# EAGLE design Proper (EAGLE 9.6.2)
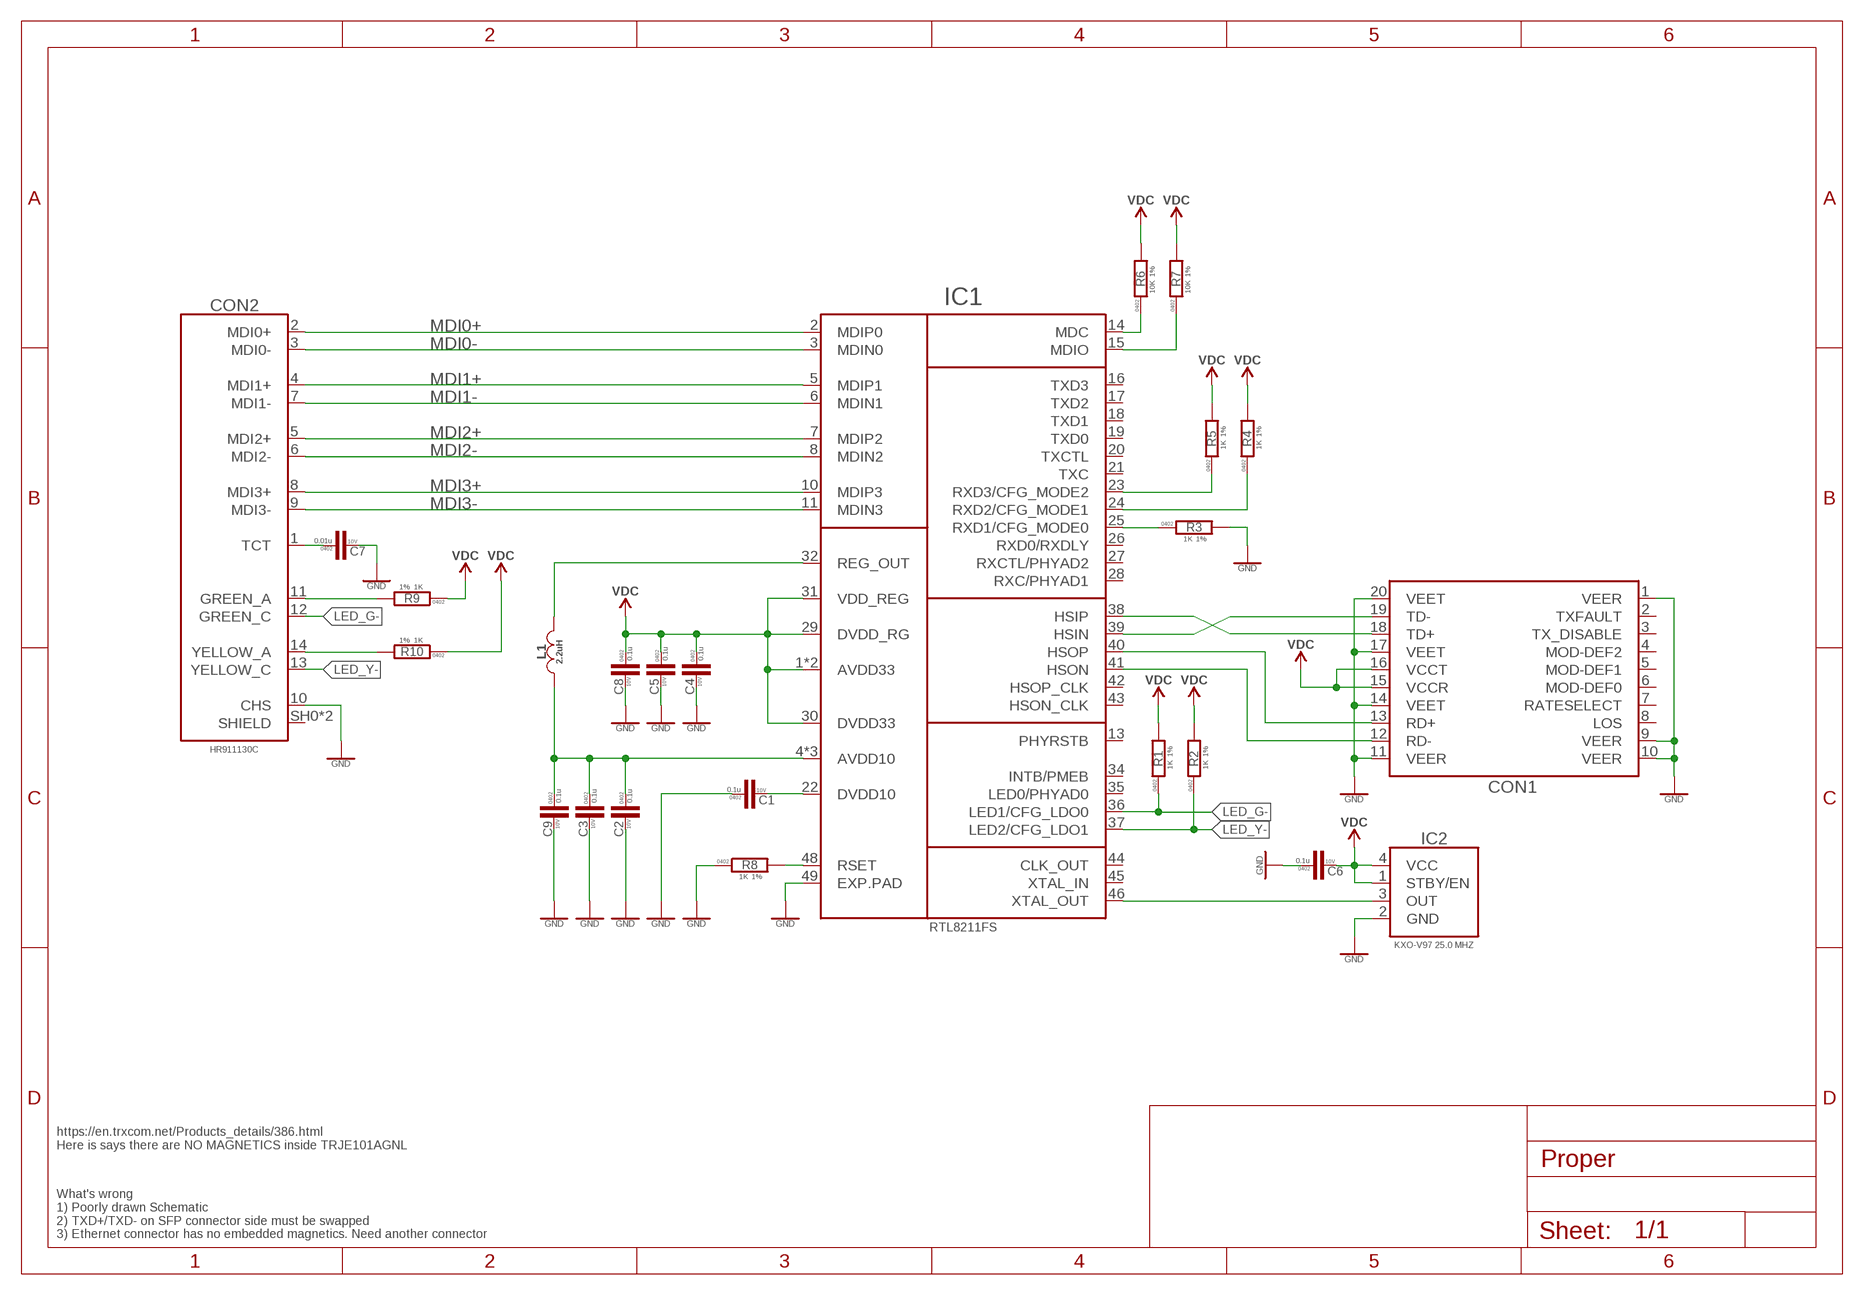
[diagram p0: schematic, sheet 1]

## Parts
C1  0.1u  C-0402  [C0402]
C2  0.1u  C-0402  [C0402]
C3  0.1u  C-0402  [C0402]
C4  0.1u  C-0402  [C0402]
C5  0.1u  C-0402  [C0402]
C6  0.1u  C-0402  [C0402]
C7  0.01u  C-0402  [C0402]
C8  0.1u  C-0402  [C0402]
C9  0.1u  C-0402  [C0402]
CON1  SFA_EDGE_CON  [SFP_EDGE_CON]
CON2  HR911130C  [HR911130C]
IC1  RTL8211FS  [QFN40]
IC2  OSCILLATOR-KXO-V97  [KXO-V97]
L1  2.2uH  L-0805  [L0805]
R1  1K  R-1%-0402  [R0402]
R2  1K  R-1%-0402  [R0402]
R3  1K  R-1%-0402  [R0402]
R4  1K  R-1%-0402  [R0402]
R5  1K  R-1%-0402  [R0402]
R6  10K  R-1%-0402  [R0402]
R7  10K  R-1%-0402  [R0402]
R8  1K  R-1%-0402  [R0402]
R9  1K  R-1%-0402  [R0402]
R10  1K  R-1%-0402  [R0402]

## Nets
GND: C1.1 C2.2 C3.2 C4.2 C5.2 C6.1 C7.2 C8.2 C9.2 CON1.1(VEER) CON1.9(VEER) CON1.10(VEER) CON1.11(VEER) CON1.14(VEET) CON1.17(VEET) CON1.20(VEET) CON2.10(CHS) IC1.49(EXP.PAD) IC2.2(GND) R3.2 R8.1
LED_G-: CON2.12(GREEN_C) IC1.36(LED1/CFG_LDO0) R1.1
LED_Y-: CON2.13(YELLOW_C) IC1.37(LED2/CFG_LDO1) R2.1
MDI0+: CON2.2(MDI0+) IC1.2(MDIP0)
MDI0-: CON2.3(MDI0-) IC1.3(MDIN0)
MDI1+: CON2.4(MDI1+) IC1.5(MDIP1)
MDI1-: CON2.7(MDI1-) IC1.6(MDIN1)
MDI2+: CON2.5(MDI2+) IC1.7(MDIP2)
MDI2-: CON2.6(MDI2-) IC1.8(MDIN2)
MDI3+: CON2.8(MDI3+) IC1.10(MDIP3)
MDI3-: CON2.9(MDI3-) IC1.11(MDIN3)
N$1: CON1.18(TD+) IC1.38(HSIP)
N$2: CON1.19(TD-) IC1.39(HSIN)
N$3: IC1.23(RXD3/CFG_MODE2) R5.1
N$4: IC1.24(RXD2/CFG_MODE1) R4.1
N$5: IC1.25(RXD1/CFG_MODE0) R3.1
N$6: IC1.14(MDC) R6.1
N$7: IC1.15(MDIO) R7.1
N$8: IC1.48(RSET) R8.2
N$9: C1.2 IC1.22(DVDD10)
N$10: IC1.32(REG_OUT) L1.2
N$11: C2.1 C3.1 C9.1 IC1.4(AVDD10) IC1.9(AVDD10) IC1.47(AVDD10) L1.1
N$12: C7.1 CON2.1(TCT)
N$14: CON1.13(RD+) IC1.40(HSOP)
N$15: CON1.12(RD-) IC1.41(HSON)
N$16: CON2.11(GREEN_A) R9.2
N$17: IC1.46(XTAL_OUT) IC2.3(OUT)
N$18: CON2.14(YELLOW_A) R10.2
VDC: C4.1 C5.1 C6.2 C8.1 CON1.15(VCCR) CON1.16(VCCT) IC1.1(AVDD33) IC1.12(AVDD33) IC1.29(DVDD_RG) IC1.30(DVDD33) IC1.31(VDD_REG) IC2.1(STBY/EN) IC2.4(VCC) R1.2 R2.2 R4.2 R5.2 R6.2 R7.2 R9.1 R10.1
Unconnected: CON1.2(TXFAULT) CON1.3(TX_DISABLE) CON1.4(MOD-DEF2) CON1.5(MOD-DEF1) CON1.6(MOD-DEF0) CON1.7(RATESELECT) CON1.8(LOS) CON2.SH0(SHIELD) CON2.SH1(SHIELD) IC1.13(PHYRSTB) IC1.16(TXD3) IC1.17(TXD2) IC1.18(TXD1) IC1.19(TXD0) IC1.20(TXCTL) IC1.21(TXC) IC1.26(RXD0/RXDLY) IC1.27(RXCTL/PHYAD2) IC1.28(RXC/PHYAD1) IC1.34(INTB/PMEB) IC1.35(LED0/PHYAD0) IC1.42(HSOP_CLK) IC1.43(HSON_CLK) IC1.44(CLK_OUT) IC1.45(XTAL_IN)

## Notes on the sheet
- https://en.trxcom.net/Products_details/386.html
  Here is says there are NO MAGNETICS inside TRJE101AGNL
- What's wrong
  1) Poorly drawn Schematic 
  2) TXD+/TXD- on SFP connector side must be swapped
  3) Ethernet connector has no embedded magnetics. Need another connector

## Library data of the parts
C1-C9 = rc:C; PACKAGE: 0402; VOLTAGE: 10V
CON1 = misc:SFA_EDGE_CON
CON2 = Connectors:HR911130C: Single Port RJ45 Connector with Integrated Magnetics and LED 100/1000Base-T Magnetics; MANF: HanRun; MANF#: HR911130C
IC1 = misc:RTL8211FS: Highly integrated Ethernet transciever Datasheet <https://static.chipdip.ru/lib/818/DOC059818733.pdf>; MANF: Realtek; MANF#: RTL8211FS
IC2 = crystal:OSCILLATOR: Clock Oscillator; MANF: GEYER; MANF#: KXO-V97 25.0 MHZ
L1 = rc:L
R1-R10 = rc:R; PACKAGE: 0402; TOLERANCE: 1%

## Board
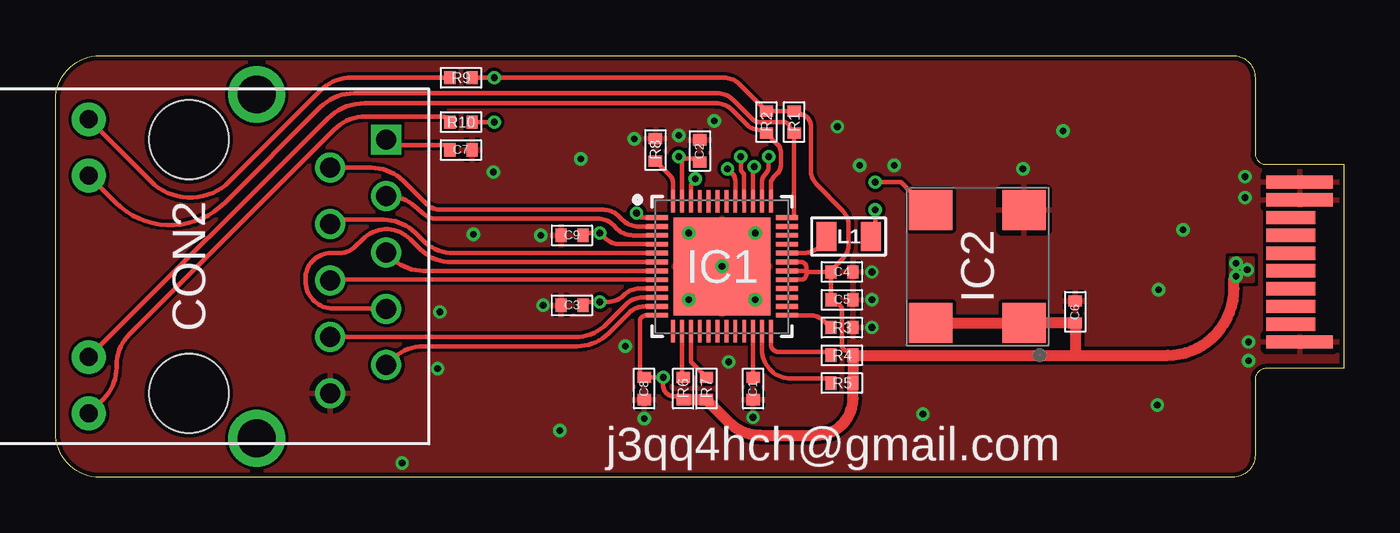
[diagram p1: board, top side]
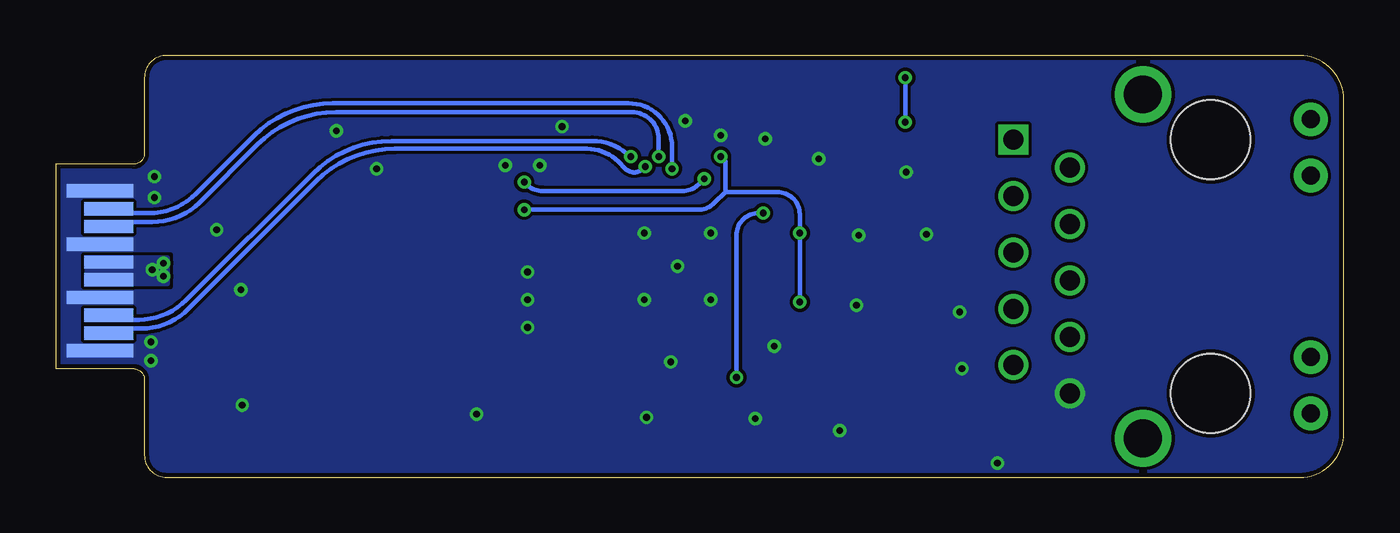
[diagram p2: board, bottom side, seen from below]

Size 58 x 19 mm. Coordinates in mm from the lower left corner, seen from the top.
Outline: 0,2 0,17 arc-90 2,19 53,19 arc-90 54,18 54,14.6 arc90 54.5,14.1 58,14.1 58,4.9 54.5,4.9 arc90 54,4.4 54,1 arc-90 53,0 2,0 arc-90 0,2
Copper layers (1*16): Top 0.035mm / dielectric 1.5mm / Bottom 0.035mm
Design rules "JLCPCB 2 layer": minimum track width 6mil, minimum drill 0.3mm, track to track 0.15mm, track to pad 0.15mm, pad to pad 0.15mm, via to via 0.15mm, smd to smd 0.1mm, copper to edge 0.2mm, drill to drill 6mil, minimum pad ring 0.15mm, minimum via ring 0.15mm, stop-mask expansion 0.05mm, vias tented up to drill 0.5mm, thermal gap 10mil

### Footprints (pad centres in the part's own frame; a part is rotated, then mirrored left to right if it is on the bottom)
C0402 = smd 0.5 x 0.6: 1 -0.5,0; 2 0.5,0
SFP_EDGE_CON = smd 3 x 0.6 bottom: 1 -2,3.4; 9 -2,-3; 10 -2,-3.8 | smd 2.2 x 0.6 bottom: 2 -2.4,2.6; 3 -2.4,1.8; 4 -2.4,1; 5 -2.4,0.2; 6 -2.4,-0.6; 7 -2.4,-1.4; 8 -2.4,-2.2 | smd 3 x 0.6: 11 -2,-3.4; 14 -2,-1; 17 -2,1.4; 20 -2,3.8 | smd 2.2 x 0.6: 12 -2.4,-2.6; 13 -2.4,-1.8; 15 -2.4,-0.2; 16 -2.4,0.6; 18 -2.4,2.2; 19 -2.4,3
HR911130C = drill 0.9 square: 1 5.715,-8.89 | drill 0.9: 2 4.445,-6.35; 3 3.175,-8.89; 4 1.905,-6.35; 5 0.635,-8.89; 6 -0.635,-6.35; 7 -1.905,-8.89; 8 -3.175,-6.35; 9 -4.445,-8.89; 10 -5.715,-6.35 | drill 0.813 pad 1.524: 11 6.625,4.5; 12 4.085,4.5; 13 -4.085,4.5; 14 -6.625,4.5 | drill 1.7: SH0 -7.745,-3.05; SH1 7.745,-3.05 | hole 3.556: 5.715,0; -5.715,0
QFN40 = smd 1 x 0.2: 1 -2.925,2.2; 2 -2.925,1.8; 3 -2.925,1.4; 4 -2.925,1; 5 -2.925,0.6; 6 -2.925,0.2; 7 -2.925,-0.2; 8 -2.925,-0.6; 9 -2.925,-1; 10 -2.925,-1.4; 11 -2.925,-1.8; 12 -2.925,-2.2; 25 2.925,-2.2; 26 2.925,-1.8; 27 2.925,-1.4; 28 2.925,-1; 29 2.925,-0.6; 30 2.925,-0.2; 31 2.925,0.2; 32 2.925,0.6; 33 2.925,1; 34 2.925,1.4; 35 2.925,1.8; 36 2.925,2.2 | smd 0.2 x 1: 13 -2.2,-2.925; 14 -1.8,-2.925; 15 -1.4,-2.925; 16 -1,-2.925; 17 -0.6,-2.925; 18 -0.2,-2.925; 19 0.2,-2.925; 20 0.6,-2.925; 21 1,-2.925; 22 1.4,-2.925; 23 1.8,-2.925; 24 2.2,-2.925; 37 2.2,2.925; 38 1.8,2.925; 39 1.4,2.925; 40 1,2.925; 41 0.6,2.925; 42 0.2,2.925; 43 -0.2,2.925; 44 -0.6,2.925; 45 -1,2.925; 46 -1.4,2.925; 47 -1.8,2.925; 48 -2.2,2.925 | smd 4.4 x 4.4: 49 0,0
KXO-V97 = smd 1.8 x 2: 1 -2.54,-2.1; 2 2.54,-2.1; 3 2.54,2.1; 4 -2.54,2.1
L0805 = smd 0.9 x 1.3: 1 -1,0; 2 1,0
R0402 = smd 0.5 x 0.6: 1 -0.5,0; 2 0.5,0

### Placement (x,y rotation side)
C1  31.4,4 90 top
C2  29,14.7 90 top
C3  23.25,7.75 180 top
C4  35.4,9.25 0 top
C5  35.4,8 0 top
C6  45.9,7.45 270 top
C7  18.25,14.75 0 top
C8  26.5,4 270 top
C9  23.25,10.9 180 top
CON1  58,9.5 180 bottom
CON2  6,9.5 90 top
IC1  30,9.5 0 top
IC2  41.5,9.5 90 top
L1  35.7,10.85 180 top
R1  33.25,16 90 top
R2  32,16 90 top
R3  35.4,6.75 0 top
R4  35.4,5.5 0 top
R5  35.4,4.25 0 top
R6  28.25,4 270 top
R7  29.3,4 270 top
R8  27,14.75 270 top
R9  18.25,18 180 top
R10  18.25,16 180 top

### Tracks (layer width: path | path; a pad name or v marks a point on that pad's centre or on a via)
GND  (via drill 0.3 pad 0.6)
  other vias: 21.95,7.75 26.05,15.25 28.5,11 31.5,11 31.5,8 28.5,8 30,9.5 36.75,9.25 36.75,8 36.75,6.75 21.85,10.9 18.8,10.95 17.3,7.45 17.2,4.9 25.65,5.9 15.6,0.65 26.5,2.65 31.4,2.7 30.3,5.2 43.55,13.9 45.35,15.6 35.2,15.8 36.2,14.05 50.75,11.15 49.65,8.45 49.6,3.25 39.05,2.85 23.65,14.35 19.7,13.75 22.7,2.1 37.75,14.05 28.05,15.4 29.65,16.05 53.7,6.1 53.7,5.25 53.55,12.6 53.55,13.55
  pour Bottom (rank 3, no thermals): 54,0 0,0 0,19 54,19 54,14.6 arc90 54.5,14.1 58,14.1 58,4.9 54.5,4.9 arc90 54,4.4
  pour Top (rank 3): 54,0 0,0 0,19 54,19 54,14.6 arc90 54.5,14.1 58,14.1 58,4.9 54.5,4.9 arc90 54,4.4
LED_G-
  Top 0.2: CON2.12 2.7,12.38 arc90 7.63,12.38 11.91,16.66 arc-45 13.45,17.3 29.79,17.3 arc-45 30.49,17.01 31.35,16.15 arc45 31.71,16 32.8,16 arc-90 33.05,15.75 33.05,15.5 R1.1 33.25,11.7 IC1.36
LED_Y-
  Top 0.2: CON2.13 12.25,16.16 arc-45 13.9,16.85 29.74,16.85 arc-45 30.44,16.56 31.12,15.88 arc45 31.68,15.65 31.85,15.65 R2.1 32.5,15 arc-45 32.65,14.64 32.65,14.06 arc-45 32.5,13.7 32.35,13.55 arc45 32.2,13.19 IC1.37
MDI0+
  Top 0.2: CON2.2 14.22,13.95 arc-45 15.64,13.36 16.65,12.34 arc45 17.36,12.05 24.66,12.05 arc-45 25.37,11.76 25.53,11.59 arc45 26.24,11.3 IC1.2
MDI0-
  Top 0.2: IC1.3 25.99,10.9 arc-45 25.28,11.19 25.12,11.36 arc45 24.41,11.65 17.18,11.65 arc-45 16.47,11.94 16.33,12.09 arc45 14.91,12.68 CON2.3
MDI1+
  Top 0.2: IC1.5 17.93,10.1 arc-45 16.51,10.69 16.18,11.02 arc45 14.77,11.61 12.83,11.61 arc45 CON2.4
MDI1-
  Top 0.2: IC1.6 17.82,9.7 arc-45 16.41,10.29 15.96,10.74 arc90 13.84,10.74 13.49,10.39 arc-45 12.79,10.1 12.4,10.1 arc90 11.25,8.95 11.25,8.85 arc90 12.5,7.6 CON2.7
MDI2+
  Top 0.2: IC1.7 16.55,9.3 arc-45 15.14,9.89 CON2.5
MDI2-
  Top 0.2: CON2.6 12.38,8.9 IC1.8
MDI3+
  Top 0.2: IC1.10 26.41,8.1 arc45 25.71,7.81 24.81,6.91 arc-45 23.4,6.33 CON2.8
MDI3-
  Top 0.2: IC1.11 26.51,7.7 arc45 25.81,7.41 24.89,6.49 arc-45 23.47,5.9 16.56,5.9 arc45 15.15,5.31 CON2.9
N$1  (via drill 0.3 pad 0.6)
  Top 0.2: v32.1,14.45 32.1,14.01 arc-45 31.95,13.65 31.95,13.65 arc45 31.8,13.29 IC1.38
  Bottom 0.2: CON1.18 55.4,7.1 54.24,7.1 arc-45 52.12,7.98 46.41,13.69 arc45 42.88,15.15 33.83,15.15 arc45 32.14,14.45 v32.1,14.45
N$2  (via drill 0.3 pad 0.6)
  Top 0.2: v31.45,14 31.4,13.95 IC1.39
  Bottom 0.2: CON1.19 55.4,6.7 54.14,6.7 arc-45 52.02,7.58 46.26,13.34 arc45 42.73,14.8 34.08,14.8 arc45 32.66,14.21 32.35,13.9 arc-90 31.55,13.9 v31.45,14
N$3
  Top 0.2: IC1.23 31.8,5.75 arc90 33.1,4.45 34.9,4.45 R5.1
N$4
  Top 0.2: IC1.24 32.2,6 arc90 32.55,5.65 34.9,5.65 R4.1
N$5
  Top 0.2: IC1.25 33.94,7.3 arc-45 34.64,7.01 R3.1
N$6
  Top 0.2: IC1.14 28.2,4.55 R6.1
N$7
  Top 0.2: IC1.15 28.6,5.2 R7.1
N$8
  Top 0.2: R8.2 27.65,13.6 arc-45 27.8,13.24 IC1.48
N$9
  Top 0.2: IC1.22 C1.2
N$10
  Top 0.2: L1.2 34.7,10.7 34.39,10.39 arc-45 33.69,10.1 IC1.32
N$11  (via drill 0.3, 0.3 pad 0.6)
  Top 0.2: IC1.4 25.41,10.5 arc-45 24.71,10.79 v24.5,11 23.85,11 C9.1 | IC1.9 26.29,8.5 arc45 25.58,8.21 25.57,8.19 arc-45 24.86,7.9 v24.5,7.9 23.9,7.9 C3.1 | L1.1 36.9,11.05 v36.9,12.05 | IC1.47 28.2,14.3 v28.05,14.45 28.15,14.35 28.85,14.35 C2.1
  Bottom 0.2: v24.5,7.9 v24.5,11 24.5,11.85 arc-90 25.5,12.85 27.85,12.85 | v28.05,14.45 27.85,14.25 27.85,12.85 | v36.9,12.05 29.06,12.05 arc-45 28.36,12.34 27.85,12.85
N$12
  Top 0.2: C7.1 17.75,14.86 17.64,14.96 15.14,14.96 CON2.1
N$14  (via drill 0.3 pad 0.6)
  Top 0.2: v30.85,14.45 30.85,13.8 31,13.66 IC1.40 | v30.85,14.45
  Bottom 0.2: CON1.13 55.4,11.5 53.64,11.5 arc-45 51.52,12.38 48.91,14.99 arc45 45.38,16.45 32.05,16.45 arc90 30.85,15.25 v30.85,14.45
N$15  (via drill 0.3 pad 0.6)
  Top 0.2: IC1.41 30.6,13.34 arc45 30.45,13.7 v30.25,13.9
  Bottom 0.2: CON1.12 55.4,11.9 53.79,11.9 arc-45 51.67,12.78 49.06,15.39 arc45 45.53,16.85 32.2,16.85 arc90 30.25,14.9 v30.25,13.9
N$16
  Top 0.2: CON2.11 4.3,13.33 arc90 7.83,13.33 11.91,17.41 arc-45 13.33,18 R9.2
N$17  (via drill 0.3 pad 0.6)
  Top 0.2: IC2.3 39.4,12.84 38.51,12.84 38.05,13.3 v36.9,13.3 | v28.8,13.45 28.75,13.4 arc45 28.6,13.04 IC1.46
  Bottom 0.2: v36.9,13.3 36.79,13.19 arc-45 36.09,12.9 29.76,12.9 arc-45 29.06,13.19 v28.8,13.45
N$18
  Top 0.2: CON2.14 2.16,3.54 arc45 2.75,4.95 2.75,5.05 arc-45 3.34,6.46 12.54,15.66 arc-45 13.95,16.25 17.5,16.25 R10.2
VDC  (via drill 0.3 pad 0.6)
  Top 0.2: R6.2 28.1,3.65 27.85,3.65 arc-90 27.35,4.15 v27.35,4.5 C8.1 26.3,4.5 26.3,7 arc-90 26.6,7.3 IC1.12 | R4.2 35.9,5.7 35.65,5.7 arc-90 35.4,5.95 35.4,7.55 arc90 35.15,7.8 34.9,7.8 C5.1 C4.1 | R10.1 v19.75,16 | R9.1 v19.75,18 30.09,18 arc-45 30.79,17.71 R2.2 R1.2 33.25,16.35 33.5,16.35 arc-90 34,15.85 34,13.86 arc45 34.29,13.16 35.41,12.04 arc-45 35.7,11.34 35.7,10.51 arc-45 35.41,9.81 34.9,9.3 C4.1 | IC1.31 | IC1.31 33.55,9.7 arc-90 33.8,9.45 33.8,9.3 | IC1.29 33.55,8.9 arc90 33.8,9.15 33.8,9.3 | IC1.30 33.8,9.3 | 33.8,9.3 | 33.8,9.3 33.85,9.25 C4.1 | IC1.1 26.35,11.7 v26.15,11.9
  Top 0.5: IC2.4 IC2.1 C6.2 45.9,5.5 | v53.15,9.05 53.05,8.95 53.05,8.5 arc-90 50.05,5.5 45.9,5.5 | 45.9,5.5 R4.2 R5.2 35.9,3.55 arc-90 34.25,1.9 31.73,1.9 arc-45 30.31,2.49 R7.2 R6.2
  Bottom 0.2: v19.75,16 v19.75,18 | v26.15,11.9 26.35,11.9 arc-90 27.35,10.9 v27.35,4.5
  other vias: 53.15,9.65 53.65,9.35
  pour Bottom (no thermals): 56.6,9.9 52.95,9.9 52.95,8.7 56.6,8.7
  pour Top (no thermals): 52.9,9.85 53.9,9.85 53.9,8.85 52.9,8.85

### Text on the board
tPlace: j3qq4hch@gmail.com